# Altium schematic sheet Connections1.SchDoc
size A3; SheetNumber: 12; SheetTotal: 12
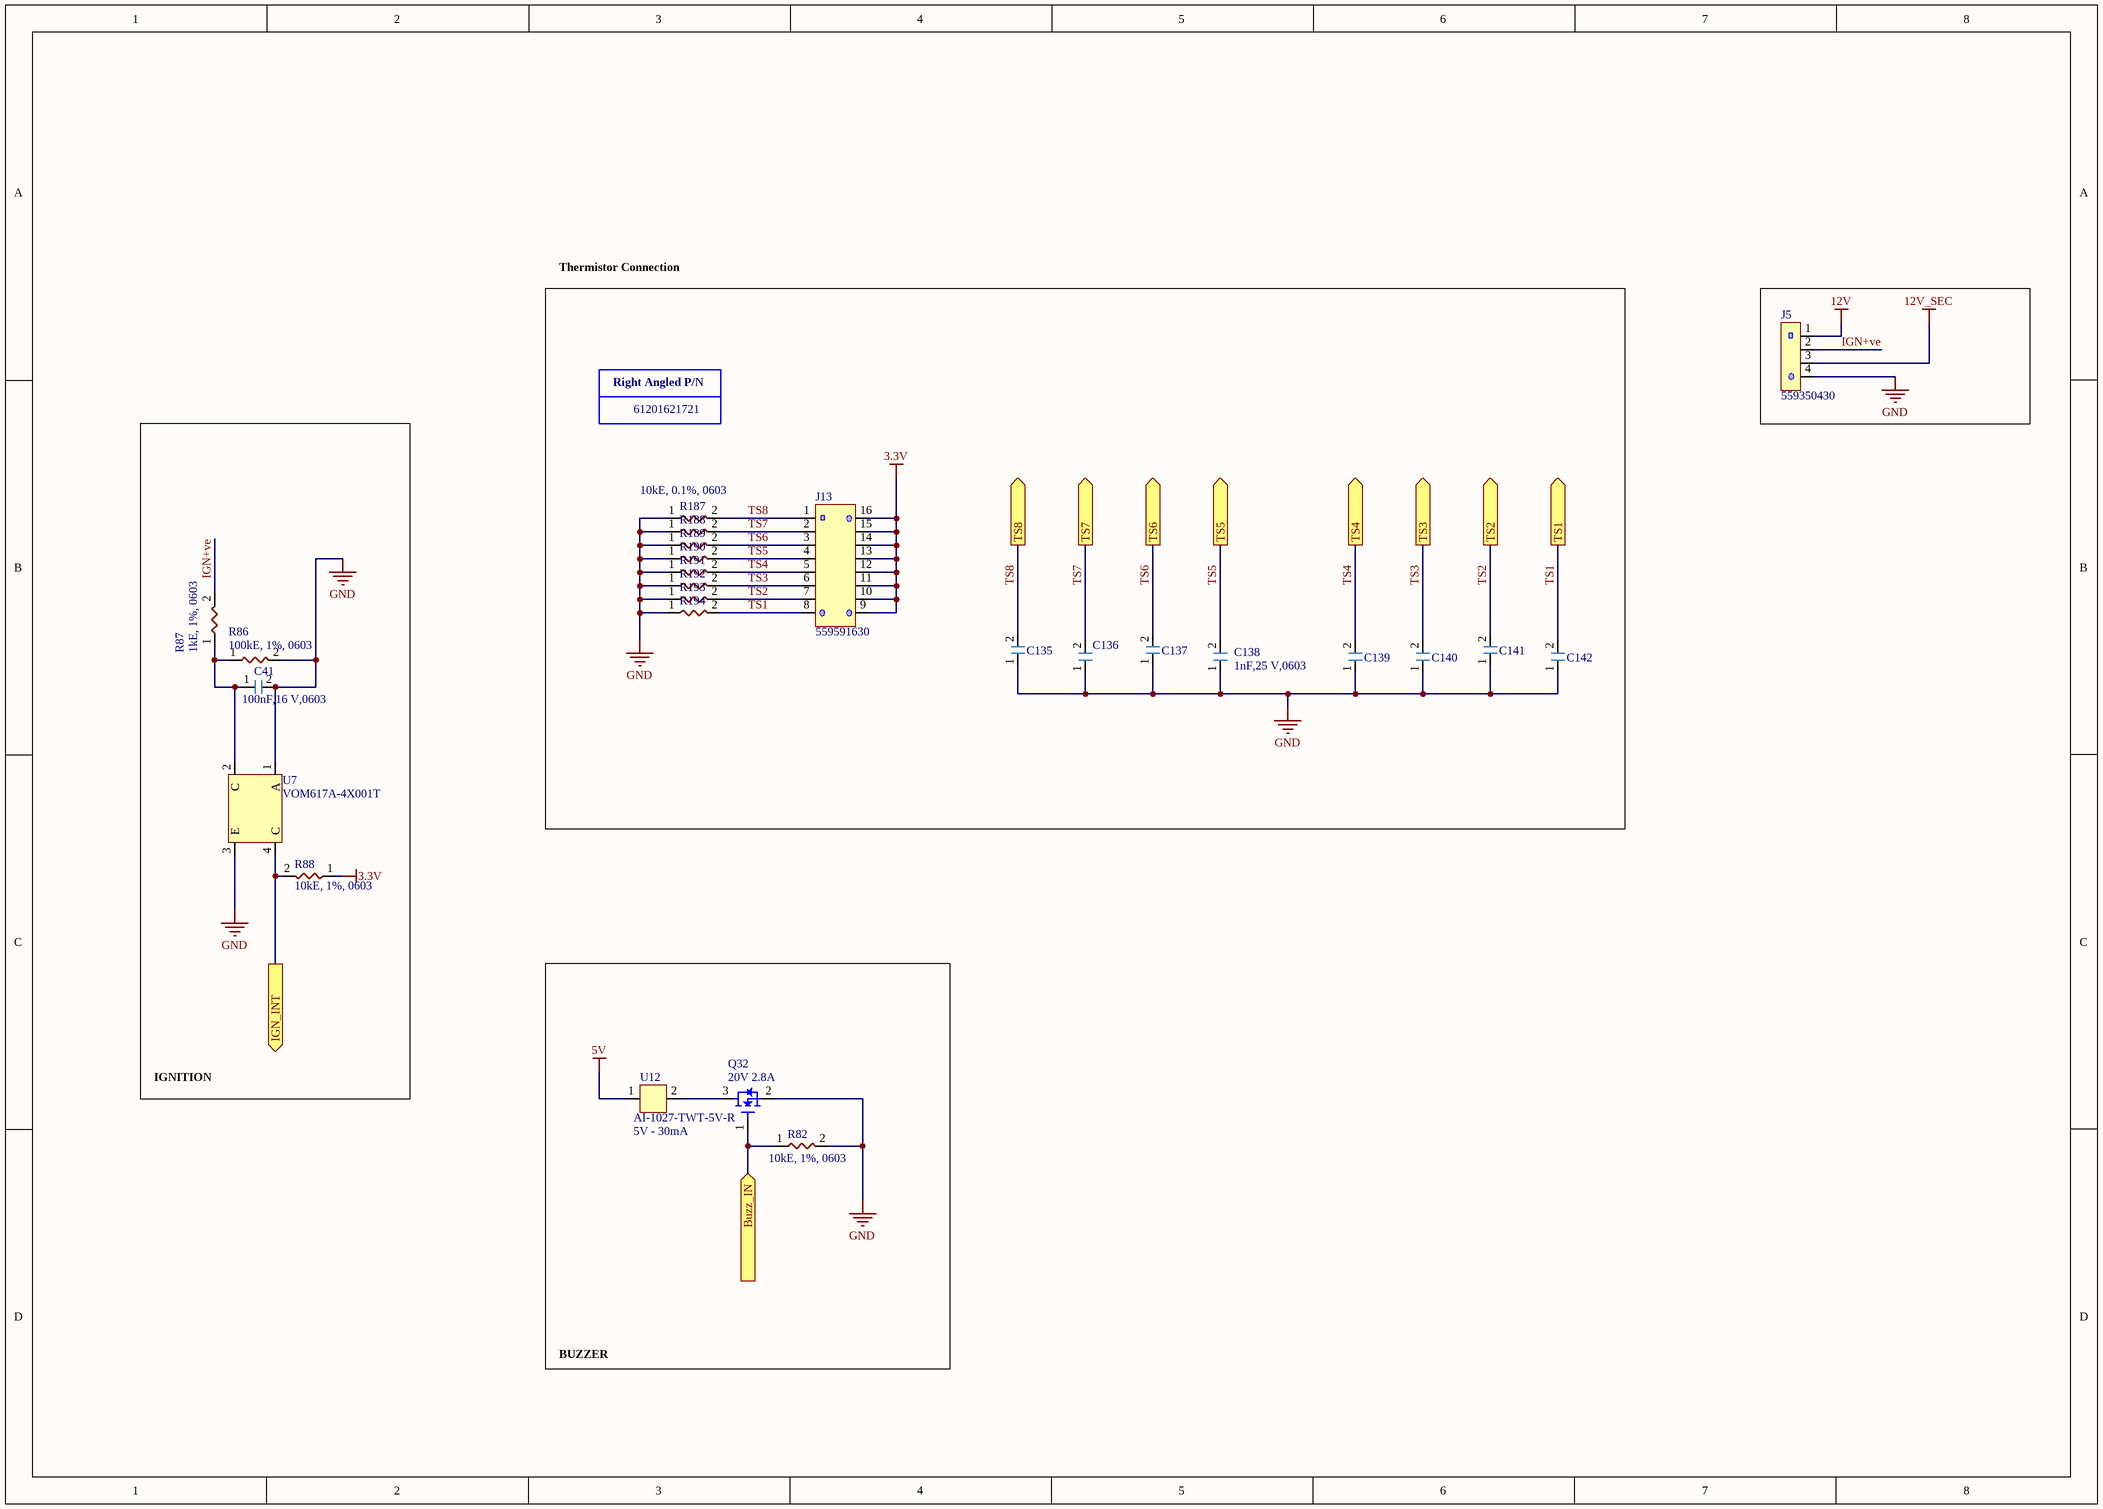
[diagram p0: Connections1.SchDoc]

## Parts
C41  Value Display: 100nF,16 V,0603  [CAPC1608X05N 0603]  (hidden comment: CC0603KRX7R7BB104)
C135  C0603C102J3GACAUTO  [CAPC1608X05N 0603]  (value not drawn)
C136  C0603C102J3GACAUTO  [CAPC1608X05N 0603]  (value not drawn)
C137  C0603C102J3GACAUTO  [CAPC1608X05N 0603]  (value not drawn)
C138  Value Display: 1nF,25 V,0603  [CAPC1608X05N 0603]  (hidden comment: C0603C102J3GACAUTO)
C139  C0603C102J3GACAUTO  [CAPC1608X05N 0603]  (value not drawn)
C140  C0603C102J3GACAUTO  [CAPC1608X05N 0603]  (value not drawn)
C141  C0603C102J3GACAUTO  [CAPC1608X05N 0603]  (value not drawn)
C142  C0603C102J3GACAUTO  [CAPC1608X05N 0603]  (value not drawn)
J5  559350430  [Con_559350430]
J13  559591630  [Con_0559591630]
Q32  Value Display: 20V 2.8A  [SOT95P255X140-3N]  (hidden comment: DMG2302UK-7)
R82  Value Display: 10kE, 1%, 0603  [RESC1608X05N 0603]  (hidden comment: CRCW060310K0FKEA)
R86  Value Display: 100kE, 1%, 0603  [RESC1608X05N 0603]  (hidden comment: CRCW0805100KFKEA)
R87  Value Display: 1kE, 1%, 0603  [RESC1608X05N 0603]  (hidden comment: AC0603FR-7W1KL)
R88  Value Display: 10kE, 1%, 0603  [RESC1608X05N 0603]  (hidden comment: CRCW060310K0FKEA)
R187  Value Display: 10kE, 0.1%, 0603  [RESC1608X05N 0603]  (hidden comment: RNCF0603BTE10K0)
R188  RNCF0603BTE10K0  [RESC1608X05N 0603]  (value not drawn)
R189  RNCF0603BTE10K0  [RESC1608X05N 0603]  (value not drawn)
R190  RNCF0603BTE10K0  [RESC1608X05N 0603]  (value not drawn)
R191  RNCF0603BTE10K0  [RESC1608X05N 0603]  (value not drawn)
R192  RNCF0603BTE10K0  [RESC1608X05N 0603]  (value not drawn)
R193  RNCF0603BTE10K0  [RESC1608X05N 0603]  (value not drawn)
R194  RNCF0603BTE10K0  [RESC1608X05N 0603]  (value not drawn)
U7  VOM617A-4X001T  [SOIC127P700X220-4N TLP293]
U12  AI-1027-TWT-5V-R  Value Display: 5V - 30mA  [Buzzer]

## Blocks framed on the sheet
IGNITION: C41 R86-R88 U7
BUZZER: Q32 R82 U12

## Ports
Buzz_IN (in), IGN_INT (out), TS1 (out), TS2 (out), TS3 (out), TS4 (out), TS5 (out), TS6 (out), TS7 (out), TS8 (out)

## Nets
3.3V: J13.9 J13.10 J13.11 J13.12 J13.13 J13.14 J13.15 J13.16 R88.1
5V: U12.1(+ve)
12V: J5.1
12V_SEC: J5.3
GND: C41.2 C135.1 C136.1 C137.1 C138.1 C139.1 C140.1 C141.1 C142.1 J5.4 Q32.2(Source) R82.2 R86.2 R187.1 R188.1 R189.1 R190.1 R191.1 R192.1 R193.1 R194.1 U7.1(A) U7.3(E)
Buzz_IN: Q32.1(Gate) R82.1 ; port Buzz_IN
IGN+ve: J5.2 R87.2
IGN_INT: R88.2 U7.4(C) ; port IGN_INT
TS1: C142.2 J13.8 R194.2 ; port TS1
TS2: C141.2 J13.7 R193.2 ; port TS2
TS3: C140.2 J13.6 R192.2 ; port TS3
TS4: C139.2 J13.5 R191.2 ; port TS4
TS5: C138.2 J13.4 R190.2 ; port TS5
TS6: C137.2 J13.3 R189.2 ; port TS6
TS7: C136.2 J13.2 R188.2 ; port TS7
TS8: C135.2 J13.1 R187.2 ; port TS8
NetC41_1: C41.1 R86.1 R87.1 U7.2(C)
NetQ32_3: Q32.3(Drain) U12.2(-ve)

## Notes on the sheet
- Thermistor Connection
- Right Angled P/N
- 61201621721

## Library data of the parts
C41 = Cap_CC0603KRX7R7BB104: Multilayer Ceramic Capacitor, 100 nF, 16V, ±10%,  X7R 0603 [1608 Metric]; Manufacturer: Yageo; Value: 100nF; Max Temp: 125 degC; Min Temp: -55 degC; Polarized: No; AEC-Q: NA; Manufacturer Part Number: CC0603KRX7R7BB104; Category: Capacitor; ComponentLink1Description: Datasheet; Mount Type: Surface Mount; Package: 0603; RoHS: Yes; Supplier 1: Digikey; Supplier 1 Part Number: 311-1088-1-ND; Supplier 1 pricing per Unit: 8.34 INR; Supplier: Mouser; Supplier Part Number: 603-CC603KRX7R7BB104; Supplier pricing per Unit: 8.34 INR; Technology: Ceramic; Temp Coefficient: X7R; Tolerance: 10%; Value 1: CC0603KRX7R7BB104; Voltage: 16V; ComponentLink1URL: https://www.yageo.com/upload/media/product/productsearch/datasheet/mlcc/UPY-GPHC_X7R_6.3V-to-250V_24.pdf
C135-C137 C139-C142 = Cap_C0603C102J3GACAUTO: Multilayer Ceramic Capacitor, 1000 pF, 25V, ±5%,  C0G 0603 [1608 Metric]; Manufacturer: KEMET; Value: 1nF; Max Temp: 125 degC; Min Temp: -55 degC; Polarized: No; Temp Coefficient: C0G, NP0; Value Display: 1nF,25 V,0603; AEC-Q: 200; Manufacturer Part Number: C0603C102J3GACAUTO; Voltage: 25V; Category: Capacitor; ComponentLink1Description: Datasheet; Mount Type: Surface Mount; Package: 0603; RoHS: Yes; Supplier 1: Digikey; Supplier 1 Part Number: 399-C0603C102J3GACAUTOCT-ND; Supplier 1 pricing per Unit: 9.17 INR; Supplier: Mouser; Supplier Part Number: 80-C0603C102J3GAUTO; Supplier pricing per Unit: 8.34 INR; Technology: Ceramic; Tolerance: 5%; Value 1: C0603C102J3GACAUTO; ComponentLink1URL: https://connect.kemet.com:7667/gateway/IntelliData-ComponentDocumentation/1.0/download/datasheet/C0603C102J3GACAUTO
C138 = Cap_C0603C102J3GACAUTO: Multilayer Ceramic Capacitor, 1000 pF, 25V, ±5%,  C0G 0603 [1608 Metric]; Manufacturer: KEMET; Value: 1nF; Max Temp: 125 degC; Min Temp: -55 degC; Polarized: No; Temp Coefficient: C0G, NP0; AEC-Q: 200; Manufacturer Part Number: C0603C102J3GACAUTO; Voltage: 25V; Category: Capacitor; ComponentLink1Description: Datasheet; Mount Type: Surface Mount; Package: 0603; RoHS: Yes; Supplier 1: Digikey; Supplier 1 Part Number: 399-C0603C102J3GACAUTOCT-ND; Supplier 1 pricing per Unit: 9.17 INR; Supplier: Mouser; Supplier Part Number: 80-C0603C102J3GAUTO; Supplier pricing per Unit: 8.34 INR; Technology: Ceramic; Tolerance: 5%; Value 1: C0603C102J3GACAUTO; ComponentLink1URL: https://connect.kemet.com:7667/gateway/IntelliData-ComponentDocumentation/1.0/download/datasheet/C0603C102J3GACAUTO
J5 = Con_559350430: 2.00mm Pitch MicroClasp Wire-to-Board Header, Dual Row, Right Angle, 4 Circuits; Crimp Part Number: 561349000; Manufacturer: Molex; Manufacturer Part Number: 0559350430; Mating Part Number: 513820400; Circuits: 4; AEC-Q: NA; Rows: 1; Value: 4 Pin; Value Display: 4 Pin/RA/TH; Category: Connector; Colour: Natural; ComponentLink1Description: Datasheet; Pitch: 2.00 mm; ComponentLink1URL: https://www.molex.com/en-us/products/part-detail-pdf/559350430?display=pdf; Mount Type: TH; Package: THT; RoHS: Yes; Supplier 1: Digikey; Supplier 1 Part Number: WM12300-ND; Supplier 1 pricing per Unit: 36.05 INR; Supplier: Mouser; Supplier Part Number: 538-55935-0430; Supplier pricing per Unit: 28.36 INR; Value 1: 559350430
J13 = Con_559591630: 2.00mm Pitch MicroClasp Wire-to-Board Header, Dual Row, Right Angle, 16 Circuits; Crimp Part Number: 561349000; Manufacturer: Molex; Manufacturer Part Number: 0559591630; Mating Part Number: 513531600; AEC-Q: No; Circuits: 16; Pitch (mm): 2.00; Rows: 2; Value: 0559591630; Category: Connector; Colour: Natural; RoHS: Yes; Supplier 1: Digikey; Supplier 1 Part Number: WM7597-ND; Supplier 1 Price per Unit: 77.84; Supplier: Mouser; Supplier Part Number: 538-55959-1630; Supplier Price per Unit: 74.23
Q32 = FET_DMG2302UK-7: N-Channel 20 V 2.8A (Ta) 660mW (Ta) Surface Mount SOT-23-3; Manufacturer: Diodes Inc.; AEC-Q: 101; Forward Voltage: 20V; Max Temp: 150 degC; Min Temp: -55 degC; Rds ON: 90mOhms @ 3.6A, 4.5V; Manufacturer Part Number: DMG2302UK-7; Value: 20V 2.8A; RoHS: Yes; Category: MOSFET; ComponentLink1Description: Datasheet; ComponentLink1URL: https://www.diodes.com/assets/Datasheets/DMG2302UK.pdf; Forward Current: 2.8A; Mount Type: Surface Mount; Package: SOT 23-3; Power: 660mW; Supplier 1: Digikey; Supplier 1 Part Number: DMG2302UK-7DICT-ND; Supplier 1 pricing per Unit: 28.35 INR; Supplier: Mouser; Supplier Part Number: 621-DMG2302UK-7; Supplier pricing per Unit: 22.52 INR; Value 1: DMG2302UK-7; Voltage: 20V; Channel: N-Channel
R82 R88 = Res_CRCW060310K0FKEA: SMD Chip Resistor, 10 kOhm,±1%, 100 mW, 0603 [1608 Metric], Thick Film, General Purpose; Manufacturer: Vishay Dale; AEC-Q: 200; Max Temp: 155 degC; Min Temp: -55 degC; Power: 1/10W; Value: 10k R; Category: Resistor; ComponentLink1Description: Datasheet; ComponentLink1URL: https://www.vishay.com/docs/20035/dcrcwe3.pdf; Manufacturer Part Number: CRCW060310K0FKEA; Mount Type: Surface Mount; Package: 0603; RoHS: Yes; Supplier 1: Digikey; Supplier 1 Part Number: 541-10.0KHCT-ND; Supplier 1 pricing per Unit: 8.34 INR; Supplier: Mouser; Supplier Part Number: 71-CRCW0603-10K-E3; Supplier pricing per Unit: 8.34 INR; Tolerance: 1%; Value 1: CRCW060310K0FKEA
R86 = Res_CRCW0603100KFKEA: SMD Chip Resistor, 100k Ohm, ± 1%, 100 mW, 0603 [1608 Metric], Thick Film, General Purpose; Manufacturer: Vishay Dale; AEC-Q: 200; Max Temp: 155 degC; Min Temp: -55 degC; Power: 1/10W; Value: 100k R; Manufacturer Part Number: CRCW0603100KFKEA; Category: Resistor; ComponentLink1Description: Datasheet; ComponentLink1URL: https://www.vishay.com/docs/20035/dcrcwe3.pdf; Mount Type: Surface Mount; Package: 0603; RoHS: Yes; Supplier 1: Digikey; Supplier 1 Part Number: 541-100KCCT-ND; Supplier 1 pricing per Unit: 8.34 INR; Supplier: Mouser; Supplier Part Number: 71-CRCW0603-100K-E3; Supplier pricing per Unit: 8.34 INR; Tolerance: 1%; Value 1: CRCW0603100KFKEA
R87 = Res_AC0603FR-7W1KL: SMD Chip Resistor, 1k Ohms ±1% , 1/5W, 0603 (1608 Metric) Anti-Sulfur, Automotive AEC-Q200 Thick Film; Manufacturer: Yageo; AEC-Q: 200; Max Temp: 155 degC; Min Temp: -55 degC; Value: 1k R; Category: Resistor; ComponentLink1Description: Datasheet; ComponentLink1URL: https://www.yageo.com/upload/media/product/productsearch/datasheet/rchip/PYu-AC_51_RoHS_L_10.pdf; Manufacturer Part Number: AC0603FR-7W1KL; Mount Type: Surface Mount; Package: 0603; Power: 1/5 W; RoHS: Yes; Supplier 1: Digikey; Supplier 1 Part Number: 13-AC0603FR-7W1KLCT-ND; Supplier 1 pricing per Unit: 8.34 INR; Supplier: Mouser; Supplier Part Number: 603-AC0603FR-7W1KL; Supplier pricing per Unit: 8.34 INR; Tolerance: 1%; Value 1: AC0603FR-7W1KL
R187 = Res_RNCF0603BTE10K0: SMD Chip Resistor, 10 kOhm, 100 mW, 0603 [1608 Metric], Thick Film, General Purpose, High Precision; Manufacturer: Stackpole Electronics; Value: 10k R; Tolerance: 0.1%; AEC-Q: 200; Max Temp: 155 degC; Min Temp: -55 degC; Power: 1/6W; Manufacturer Part Number: RNCF0603BTE10K0; Package: 0603; Category: Resistor; ComponentLink1Description: Datasheet; ComponentLink1URL: https://www.seielect.com/catalog/sei-rncf.pdf; Mount Type: Surface Mount; RoHS: Yes; Supplier 1: Digikey; Supplier 1 Part Number: RNCF0603BTE10K0CT-ND; Supplier 1 pricing per Unit: 13.34 INR; Supplier: Mouser; Supplier Part Number: 708-RNCF0603BTE10K0; Supplier pricing per Unit: 12.51 INR; Value 1: RNCF0603BTE10K0
R188-R194 = Res_RNCF0603BTE10K0: SMD Chip Resistor, 10 kOhm, 100 mW, 0603 [1608 Metric], Thick Film, General Purpose, High Precision; Manufacturer: Stackpole Electronics; Value: 10k R; Tolerance: 0.1%; AEC-Q: 200; Max Temp: 155 degC; Min Temp: -55 degC; Power: 1/6W; Value Display: 10kE, 0.1%, 0603; Manufacturer Part Number: RNCF0603BTE10K0; Package: 0603; Category: Resistor; ComponentLink1Description: Datasheet; ComponentLink1URL: https://www.seielect.com/catalog/sei-rncf.pdf; Mount Type: Surface Mount; RoHS: Yes; Supplier 1: Digikey; Supplier 1 Part Number: RNCF0603BTE10K0CT-ND; Supplier 1 pricing per Unit: 13.34 INR; Supplier: Mouser; Supplier Part Number: 708-RNCF0603BTE10K0; Supplier pricing per Unit: 12.51 INR; Value 1: RNCF0603BTE10K0
U7 = IC_VOM617A-4X001T: Optoisolator Transistor Output 3750Vrms 1 Channel 4-SOP; Manufacturer: Vishay Dale; AEC-Q: NA; Max Temp: 110 degC; Min Temp: -55 degC; Value: 1.6V - 60mA/ 80V - 100mA; Category: Opto Coupler; ComponentLink1Description: Datasheet; ComponentLink1URL: https://www.vishay.com/docs/83446/vom617a.pdf; Manufacturer Part Number: VOM617A-4X001T; Mount Type: Surface Mount; Package: SOP 4; RoHS: Yes; Supplier 1: Digikey; Supplier 1 Part Number: VOM617A-4X001TCT-ND; Supplier 1 pricing per Unit: 52.14 INR; Supplier: Mouser; Supplier Part Number: 78-VOM617A-4X001T; Supplier pricing per Unit: 52.71 INR; Value 1: VOM617A-4X001T; Value Display: 1.6V - 60mA/ 80V - 100mA; Voltage: 3750 VRMS
U12 = IC_AI-1027-TWT-5V-R: Buzzers Indicator, Internally Driven Electromechanical/Magnetic 5 V 30mA 2.7kHz 80dB @ 5V, 10cm Through Hole PC Pins; Manufacturer: PUIaudio; AEC-Q: NA; Max Temp: 80 degC; Min Temp: -20 degC; Category: Buzzer; ComponentLink1Description: Datasheet; ComponentLink1URL: https://docs.google.com/gview?url=https://api.puiaudio.com/filename/AI-1027-TWT-5V-R.pdf&embedded=true; Manufacturer Part Number: AI-1027-TWT-5V-R; Mount Type: TH; Package: TH; RoHS: Yes; Supplier 1: Digikey; Supplier 1 Part Number: 668-1339-ND; Supplier 1 pricing per Unit: 124.45 INR; Supplier: Mouser; Supplier Part Number: 665-AI-1027TWT5VR; Supplier pricing per Unit: 123.43 INR; Value 1: AI-1027-TWT-5V-R; Value: 5V 30mA 2.7kHz; Voltage: 5V